# EAGLE design 16197^4 (EAGLE 7.6.0)
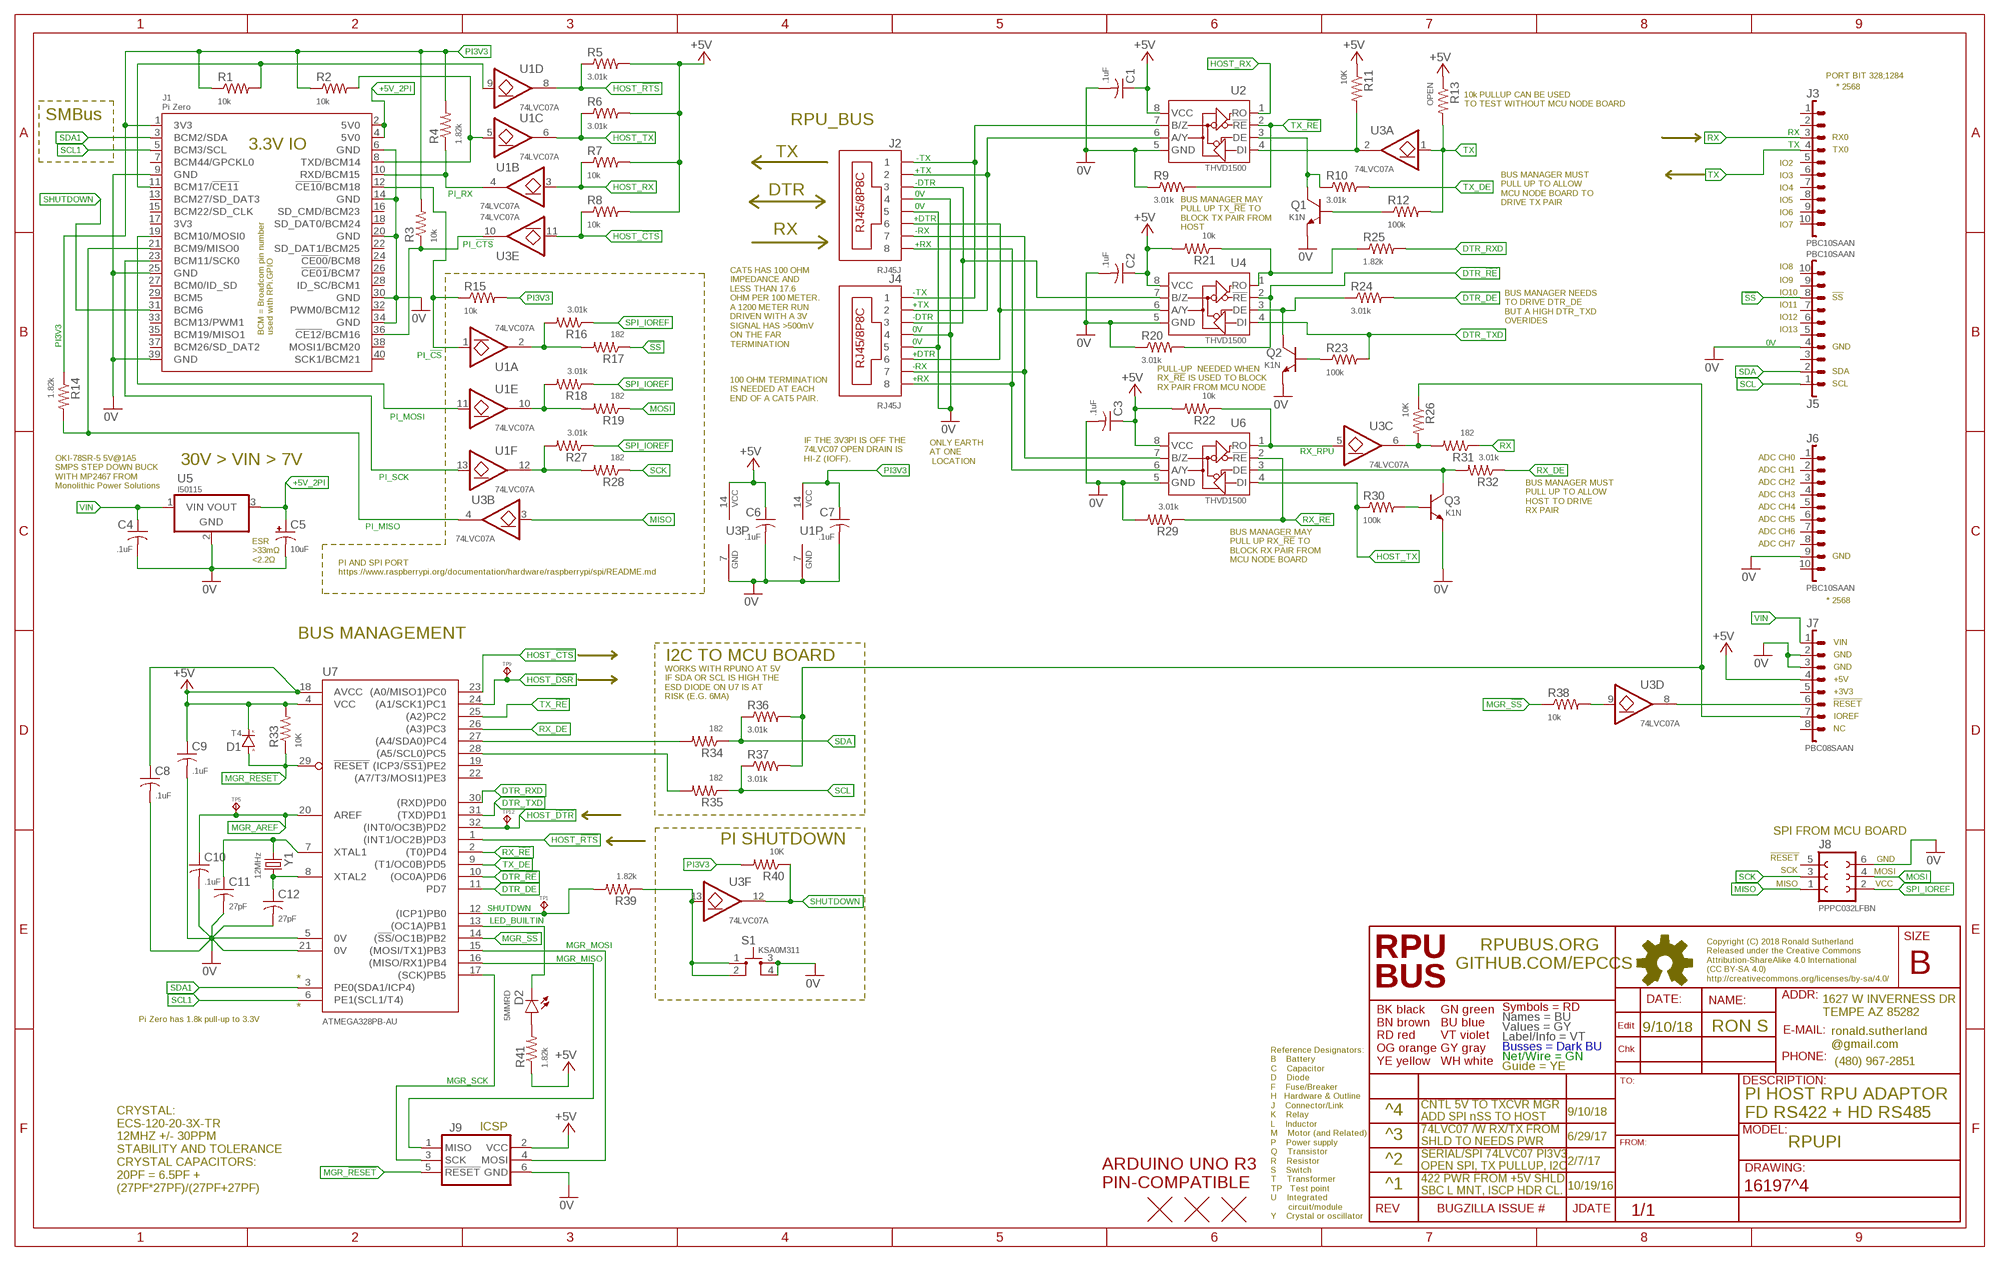
[diagram p0: schematic, sheet 1]

## Parts
C1  .1uF  CC0603A  [C0603(1608)]
C2  .1uF  CC0603A  [C0603(1608)]
C3  .1uF  CC0603A  [C0603(1608)]
C4  .1uF  CC0603A  [C0603(1608)]
C5  10uF  CT1206  [3216]
C6  .1uF  CC0603A  [C0603(1608)]
C7  .1uF  CC0603A  [C0603(1608)]
C8  .1uF  CC0603A  [C0603(1608)]
C9  .1uF  CC0603A  [C0603(1608)]
C10  .1uF  CC0603A  [C0603(1608)]
C11  27pF  CC0603A  [C0603(1608)]
C12  27pF  CC0603A  [C0603(1608)]
D1  T4  DSOD123  [SOD123]
D2  5MMRD  LED5MM  [LED5MM]
J1  Pi Zero  RPI-ZERO90  [RASPI_ZERO_V40PIN]
J2  RJ45J  RJ45-8HZT  [RJ45-8HZT]
J3  PBC10SAAN  1X10"  [1X10]
J4  RJ45J  RJ45-8HZT  [RJ45-8HZT]
J5  PBC10SAAN  1X10"  [1X10]
J6  PBC10SAAN  1X10"  [1X10]
J7  PBC08SAAN  1X8"  [1X8]
J8  PPPC032LFBN  F2X3  [F2X3]
J9  ISP-SPIPTH  [ISP]
Q1  K1N  NPNSOT23  [SOT23]
Q2  K1N  NPNSOT23  [SOT23]
Q3  K1N  NPNSOT23  [SOT23]
R1  10k  R0805  [C0805(2012)]
R2  10k  R0805  [C0805(2012)]
R3  10k  R0805  [C0805(2012)]
R4  1.82k  R0805  [C0805(2012)]
R5  3.01k  R0805  [C0805(2012)]
R6  3.01k  R0805  [C0805(2012)]
R7  10k  R0805  [C0805(2012)]
R8  10k  R0805  [C0805(2012)]
R9  3.01k  R0805  [C0805(2012)]
R10  3.01k  R0805  [C0805(2012)]
R11  10K  R0805  [C0805(2012)]
R12  100k  R0805  [C0805(2012)]
R13  OPEN  R0805  [C0805(2012)]
R14  1.82k  R0805  [C0805(2012)]
R15  10k  R0805  [C0805(2012)]
R16  3.01k  R0805  [C0805(2012)]
R17  182  R0805  [C0805(2012)]
R18  3.01k  R0805  [C0805(2012)]
R19  182  R0805  [C0805(2012)]
R20  3.01k  R0805  [C0805(2012)]
R21  10k  R0805  [C0805(2012)]
R22  10k  R0805  [C0805(2012)]
R23  100k  R0805  [C0805(2012)]
R24  3.01k  R0805  [C0805(2012)]
R25  1.82k  R0805  [C0805(2012)]
R26  10K  R0805  [C0805(2012)]
R27  3.01k  R0805  [C0805(2012)]
R28  182  R0805  [C0805(2012)]
R29  3.01k  R0805  [C0805(2012)]
R30  100k  R0805  [C0805(2012)]
R31  182  R0805  [C0805(2012)]
R32  3.01k  R0805  [C0805(2012)]
R33  10K  R0805  [C0805(2012)]
R34  182  R0805  [C0805(2012)]
R35  182  R0805  [C0805(2012)]
R36  3.01k  R0805  [C0805(2012)]
R37  3.01k  R0805  [C0805(2012)]
R38  10k  R0805  [C0805(2012)]
R39  1.82k  R0805  [C0805(2012)]
R40  10K  R0805  [C0805(2012)]
R41  1.82k  R0805  [C0805(2012)]
S1  KSA0M311  [0M311]
TP1  TPPAD1-08  [P1-08]
TP5  TPPAD1-08  [P1-08]
TP9  TPPAD1-08  [P1-08]
TP12  TPPAD1-08  [P1-08]
U1  74LVC07A  7407D  [14SOIC]
U2  THVD1500  ISL3172EIBZ  [SOIC8]
U3  74LVC07A  7407D  [14SOIC]
U4  THVD1500  ISL3172EIBZ  [SOIC8]
U5  I50115  OKI-78SR-H  [OKI-78SR-H]
U6  THVD1500  ISL3172EIBZ  [SOIC8]
U7  ATMEGA328PB-AU  [TQFP32-08]
U$1  ARDUINO-UNO  [ARDUINO_UNO]
U$2  FIDUCIAL1.27  [FIDUCIAL-1.27]
U$3  FIDUCIAL1.27  [FIDUCIAL-1.27]
U$4  FIDUCIAL1.27  [FIDUCIAL-1.27]
Y1  12MHz  CSM-3X  [CSM-3X]

## Nets
0V: C1.2 C2.2 C3.2 C4.2 C5.- C6.2 C7.2 C8.2 C9.2 C10.2 C11.2 C12.2 J1.6(GND) J1.9(GND) J1.14(GND) J1.20(GND) J1.25(GND) J1.30(GND) J1.34(GND) J1.39(GND) J2.4 J2.5 J4.4 J4.5 J5.4 J6.9 J7.2 J7.3 J8.6 J9.6(GND) Q1.E Q2.E Q3.E R9.1 R20.1 R29.2 S1.3 S1.4 U1.7(P:GND) U2.5(GND) U3.7(P:GND) U4.5(GND) U5.2(GND) U6.5(GND) U7.5(0V) U7.21(0V)
!RESET: J7.6 U3.8(D:O)
!SS: J5.8 R17.1
+5V: C1.1 C2.1 C3.1 C6.1 C8.1 C9.1 D1.C(K) J7.4 J9.2(VCC) R5.2 R6.2 R7.2 R8.2 R11.1 R13.1 R21.2 R22.2 R33.2 R41.1 U2.8(VCC) U3.14(P:VCC) U4.8(VCC) U6.8(VCC) U7.4(VCC) U7.18(AVCC)
+5V_2PI: C5.+ J1.2(5V0) J1.4(5V0) U5.3(VOUT)
+DTR: J2.6 J4.6 U4.6(A/Y)
+RX: J2.8 J4.8 U6.6(A/Y)
+TX: J2.2 J4.2 U2.6(A/Y)
-DTR: J2.3 J4.3 U4.7(B/Z)
-RX: J2.7 J4.7 U6.7(B/Z)
-TX: J2.1 J4.1 U2.7(B/Z)
DTR_!RE: R20.2 U4.2(!RE) U7.10((OC0A)PD6)
DTR_DE: R24.2 U7.11(PD7)
DTR_RXD: R25.2 U7.30((RXD)PD0)
DTR_TXD: R23.2 U4.4(DI) U7.31((TXD)PD1)
HOST_!CTS: R8.1 U3.11(E:I) U7.23((A0/MISO1)PC0)
HOST_!DSR: TP9.TP U7.24((A1/SCK1)PC1)
HOST_!DTR: TP12.TP U7.32((INT0/OC3B)PD2)
HOST_!RTS: R5.1 U1.8(D:O) U7.1((INT1/OC2B)PD3)
HOST_RX: R7.1 U1.3(B:I) U2.1(RO)
HOST_TX: R6.1 R30.1 U1.6(C:O) U6.4(DI)
IOREF: J7.7 R26.1 R36.2 R37.2
LED_BUILTIN: D2.K U7.13((OC1A)PB1)
MGR_!RESET: D1.A J9.5(!RESET) R33.1 U7.29(!RESET)
MGR_!SS!: R38.1 U7.14((!SS!/OC1B)PB2)
MGR_AREF: C10.1 TP5.TP U7.20(AREF)
MGR_MISO: J9.1(MISO) U7.16((MISO/RX1)PB4)
MGR_MOSI: J9.4(MOSI) U7.15((MOSI/TX1)PB3)
MGR_SCK: J9.3(SCK) U7.17((SCK)PB5)
MISO: J8.1 U3.3(B:I)
MOSI: J8.4 R19.1
N$1: J1.8(TXD/BCM14) R2.2 U1.5(C:I)
N$2: R38.2 U3.9(D:I)
N$3: R34.2 U7.27((A4/SDA0)PC4)
N$4: J1.11(BCM17/!CE11!) R1.2 U1.9(D:I)
N$5: R27.2 R28.2 U1.12(F:O)
N$6: R18.2 R19.2 U1.10(E:O)
N$7: R39.1 S1.1 S1.2 U3.13(F:I)
N$8: R35.2 U7.28((A5/SCL0)PC5)
N$9: R16.2 R17.2 U1.2(A:O)
N$10: R26.2 R31.2 U3.6(C:O)
N$11: Q3.C R32.2 U6.3(DE)
N$15: Q1.B R12.1
N$18: Q1.C R10.1 U2.3(DE)
N$19: R21.1 R25.1 U4.1(RO)
N$20: Q2.C R24.1 U4.3(DE)
N$22: Q2.B R23.1
N$25: Q3.B R30.2
N$29: D2.A R41.2
PI3V3: C7.1 J1.1(3V3) R1.1 R2.1 R3.2 R4.2 R14.1 R15.2 R40.2 U1.14(P:VCC)
PI_!CS: J1.12(!CE10!/BCM18) R15.1 U1.1(A:I)
PI_!CTS: J1.36(!CE12!/BCM16) R3.1 U3.10(E:O)
PI_MISO: J1.21(BCM9/MISO0) R14.2 U3.4(B:O)
PI_MOSI: J1.19(BCM10/MOSI0) U1.11(E:I)
PI_RX: J1.10(RXD/BCM15) R4.1 U1.4(B:O)
PI_SCK: J1.23(BCM11/SCK0) U1.13(F:I)
RX: J3.3 R31.1
RX_!RE: R29.1 U6.2(!RE) U7.2((T0)PD4)
RX_DE: R32.1 U7.26((A3)PC3)
RX_RPU: R22.1 U3.5(C:I) U6.1(RO)
SCK: J8.3 R28.1
SCL: J5.1 R35.1 R37.1
SCL1: J1.5(BCM3/SCL) U7.6(PE1(SCL1/T4))
SDA: J5.2 R34.1 R36.1
SDA1: J1.3(BCM2/SDA) U7.3(PE0(SDA1/ICP4))
SHUTDOWN: J1.31(BCM6) R40.1 U3.12(F:O)
SHUTDWN: R39.2 TP1.TP U7.12((ICP1)PB0)
SPI_IOREF: J8.2 R16.1 R18.1 R27.1
TX: J3.4 R12.2 R13.2 U3.1(A:I)
TX_!RE: R9.2 U2.2(!RE) U7.25((A2)PC2)
TX_DE: R10.2 U7.9((T1/OC0B)PD5)
TX_RPU: R11.2 U2.4(DI) U3.2(A:O)
VIN: C4.1 J7.1 U5.1(VIN)
XTAL1: C11.1 U7.7(XTAL1) Y1.1
XTAL2: C12.1 U7.8(XTAL2) Y1.2
Unconnected: J1.7(BCM44/GPCKL0) J1.13(BCM27/SD_DAT3) J1.15(BCM22/SD_CLK) J1.16(SD_CMD/BCM23) J1.17(3V3) J1.18(SD_DAT0/BCM24) J1.22(SD_DAT1/BCM25) J1.24(!CE00!/BCM8) J1.26(!CE01!/BCM7) J1.27(BCM0/ID_SD) J1.28(ID_SC/BCM1) J1.29(BCM5) J1.32(PWM0/BCM12) J1.33(BCM13/PWM1) J1.35(BCM19/MISO1) J1.37(BCM26/SD_DAT2) J1.38(MOSI1/BCM20) J1.40(SCK1/BCM21) J3.1 J3.2 J3.5 J3.6 J3.7 J3.8 J3.9 J3.10 J5.3 J5.5 J5.6 J5.7 J5.9 J5.10 J6.1 J6.2 J6.3 J6.4 J6.5 J6.6 J6.7 J6.8 J6.10 J7.5 J7.8 J8.5 U7.19((ICP3/!SS1!)PE2) U7.22((A7/T3/MOSI1)PE3)

## Notes on the sheet
- PORT BIT 328;1284
- * 2568
- 10k PULLUP CAN BE USED 
  TO TEST WITHOUT MCU NODE BOARD
- SMBus
- RPU_BUS
- RX0
- TX0
- TX
- IO2
- IO3
- IO4
- DTR
- IO5
- BUS MANAGER MUST
  PULL UP TO ALLOW 
  MCU NODE BOARD TO 
  DRIVE TX PAIR
- IO6
- IO7
- BUS MANAGER MAY
  PULL UP TX_!RE! TO 
  BLOCK TX PAIR FROM 
  HOST
- RX
- IO8
- IO9
- IO10
- !SS
- IO11
- IO12
- BUS MANAGER NEEDS
  TO DRIVE DTR_DE
  BUT A HIGH DTR_TXD
  OVERIDES
- IO13
- CAT5 HAS 100 OHM 
  IMPEDANCE AND 
  LESS THAN 17.6 
  OHM PER 100 METER. 
  A 1200 METER RUN
  DRIVEN WITH A 3V 
  SIGNAL HAS >500mV
  ON THE FAR
  TERMINATION
- GND
- SDA
- SCL
- PULL-UP  NEEDED WHEN 
  RX_!RE! IS USED TO BLOCK 
  RX PAIR FROM MCU NODE
- 100 OHM TERMINATION
  IS NEEDED AT EACH
  END OF A CAT5 PAIR.
- ADC CH0
- IF THE 3V3PI IS OFF THE
  74LVC07 OPEN DRAIN IS
  HI-Z (IOFF).
- ONLY EARTH
  AT ONE
   LOCATION
- 30V > VIN > 7V
- ADC CH1
- ADC CH2
- OKI-78SR-5 5V@1A5
  SMPS STEP DOWN BUCK
  WITH MP2467 FROM 
  Monolithic Power Solutions
- ADC CH3
- ADC CH4
- BUS MANAGER MUST
  PULL UP TO ALLOW 
  HOST TO DRIVE
  RX PAIR
- ADC CH5
- ADC CH6
- ADC CH7
- GND
- ESR
  >33mΩ
  <2.2Ω
- BUS MANAGER MAY
  PULL UP RX_!RE! TO 
  BLOCK RX PAIR FROM
  MCU NODE BOARD
- PI AND SPI PORT
  https://www.raspberrypi.org/documentation/hardware/raspberrypi/spi/README.md
- * 2568
- BUS MANAGEMENT
- VIN
- GND
- I2C TO MCU BOARD
- GND
- +5V
- +3V3
- WORKS WITH RPUNO AT 5V
  IF SDA OR SCL IS HIGH THE
  ESD DIODE ON U7 IS AT 
  RISK (E.G. 6MA)
- !RESET
- IOREF
- NC
- SPI FROM MCU BOARD
- PI SHUTDOWN
- !RESET
- GND
- SCK
- MOSI
- MISO
- VCC
- *
- *
- Pi Zero has 1.8k pull-up to 3.3V
- 9/10/18 | RON S
- ^4 | 9/10/18
- PI HOST RPU ADAPTOR 
  FD RS422 + HD RS485
- CNTL 5V TO TXCVR MGR
  ADD SPI nSS TO HOST
- ICSP
- ^3 | 6/29/17
- 74LVC07 /W RX/TX FROM 
  SHLD TO NEEDS PWR
- RPUPI
- ^2 | 2/7/17
- SERIAL/SPI 74LVC07 PI3V3
  OPEN SPI, TX PULLUP, I2C
- ^1 | 10/19/16
- CRYSTAL:
  ECS-120-20-3X-TR
  12MHZ +/- 30PPM
  STABILITY AND TOLERANCE
  CRYSTAL CAPACITORS:
  20PF = 6.5PF +
  (27PF*27PF)/(27PF+27PF)
- 422 PWR FROM +5V SHLD,
  SBC L MNT, ISCP HDR CL.

## Library data of the parts
C1-C4 C6-C12 = C-C:C: CAPACITOR Symbol
C5 = C-T:CT: Tantalum Electrolytic Capacitor
D1 = D-GP:D: DIODE
D2 = D-LED:LED: LED 120120WH [CREE,XHGAWT-00-0000-00000HXE1] LED WHITE 6500K 150LUM-W120120
J1 = U-Pi:RPI-ZERO: Raspberry Pi Zero https://pinout.xyz/ NOTE: WiFi is needed see https://www.kickstarter.com/projects/1991736672/iot-hat-for-raspberry-pi-a-must-have-for-pi-zero
J2 J4 = J-RJ45:RJ45-8: RJ45 Jack RJ45J [ASSMANN,A-2014-2-4-R] JACK MODULAR VERT PCB 8P8C UNSHIELD Horz version form sparkfun sku PRT-00643, and breakout board sku is BOB-00716.
J3 J5 J6 = J-HDR2.54mm:1X10: 10 POS HEADER PBC10S [SULLINS,PBC10SAAN]HEADER MALE BRKWAY 10POS .1IN AA
J7 = J-HDR2.54mm:1X8: 8 POS HEADER PBC08SAAN [SULLINS,PBC08SAAN]HEADER MALE BRKWAY 8POS .1IN AA
J8 = J-HDR2.54mm:F2X3: FEMALE HEADER 2X3POS
J9 = U-AVR:ISP-SPI: AVR ISP thru SPI In-System Programming uses the target Atmel AVR’s internal SPI (Serial Peripheral Interface) to download code into the flash and EEPROM memories. It is not a debugging interface. When designing an application PCB which includes an AVR with the SPI interface, this pinout should be used. Sparkfun SKU: BOB-08508
Q1-Q3 = Q-NPN:NPN: BJT NPN General Purpose Amplifier
R1-R41 = R-C:R: Resiistor American-style symbol
S1 = S-Tactile:KSA: KSA0M311 [C&K,KSA0M311LFT] SWITCH TACTILE SEALED SPST-NO 50MA 32V
TP1 TP5 TP9 TP12 = J-TP:TP: Test pad
U1 U3 = U-7400:74*07: HEX BUFFER, OPEN DRAIN/COLLECTOR 74LVC07A [DIODES,74LVC07AS14-13] LOGIC BUFFER OPEN DRAIN 14SOIC
U2 U4 U6 = U-Transceiver:ISL3172E: TRANSCEIVER RS485 3.3V HALFDPLX
U5 = P-DCDC:OKI-78SR: OKI-78SR OKI-78SR-5/1.5-W36H-C 5V@1.5A Horizontal Mount OKI-78SR-5/1.5-W36-C 5V@1.5A Vert Mount OKI-78SR-3.3/1.5-W36H-C 3.3V@1.5A Horizontal Mount OKI-78SR-3.3/1.5-W36-C 3.3V@1.5A Vert Mount Murata Power Solutions 7 to 36 VDC input range need to verify pinout
U7 = U-AVR:ATMEGA328PB-AU: ATmega328PB 4 Kbytes FLASH 128 bytes SRAM 256 bytes EEPROM 2 UART, 2 I2C, 2 SPI 8-channel 10 bit ADC
U$1 = J-BoardHDR:ARDUINO-UNO: Board Outline with holes and silk note the board dim layer is not defined
U$2-U$4 = H-Fiducial:FIDUCIAL: Fiducial Alignment Points Various fiducial points for machine vision alignment.
Y1 = Y-XTL:CSM: 16MHZ20 [ECS,ECS-160-20-3X-TR] CRYSTAL 16MHZ 20PF 30PPM CSM-3X

## Net classes
0 default: width 0.254 mm, drill 0.33 mm

## Board
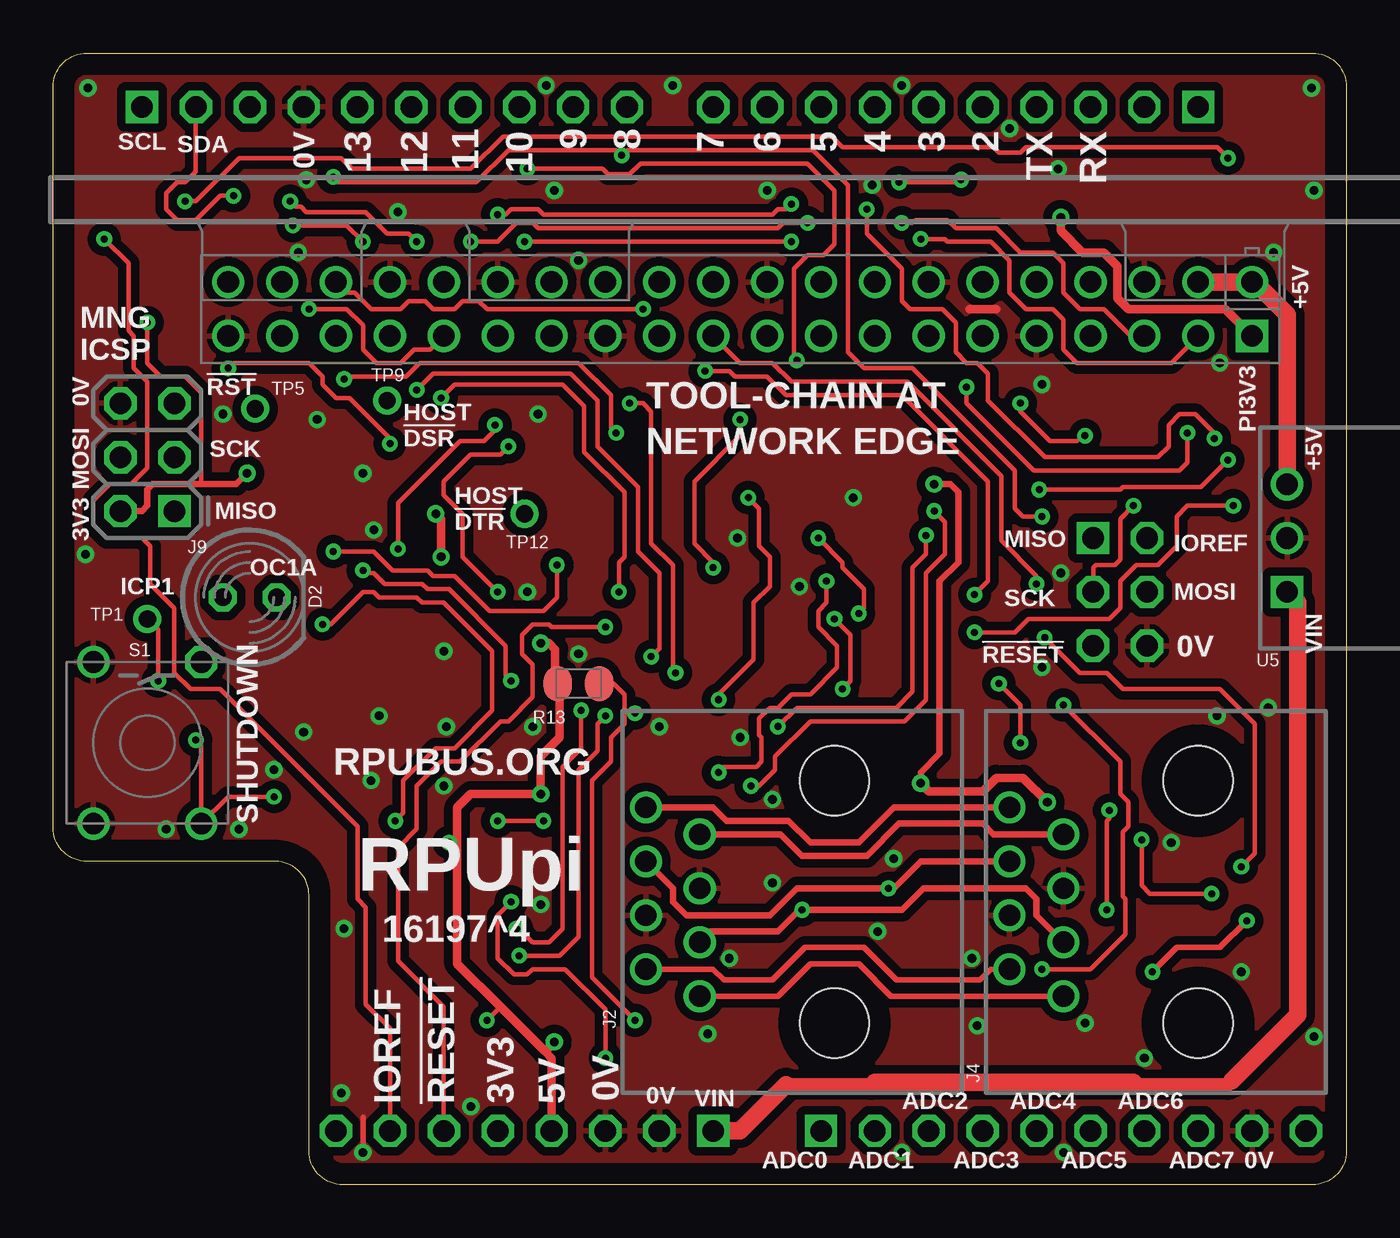
[diagram p1: board, top side]
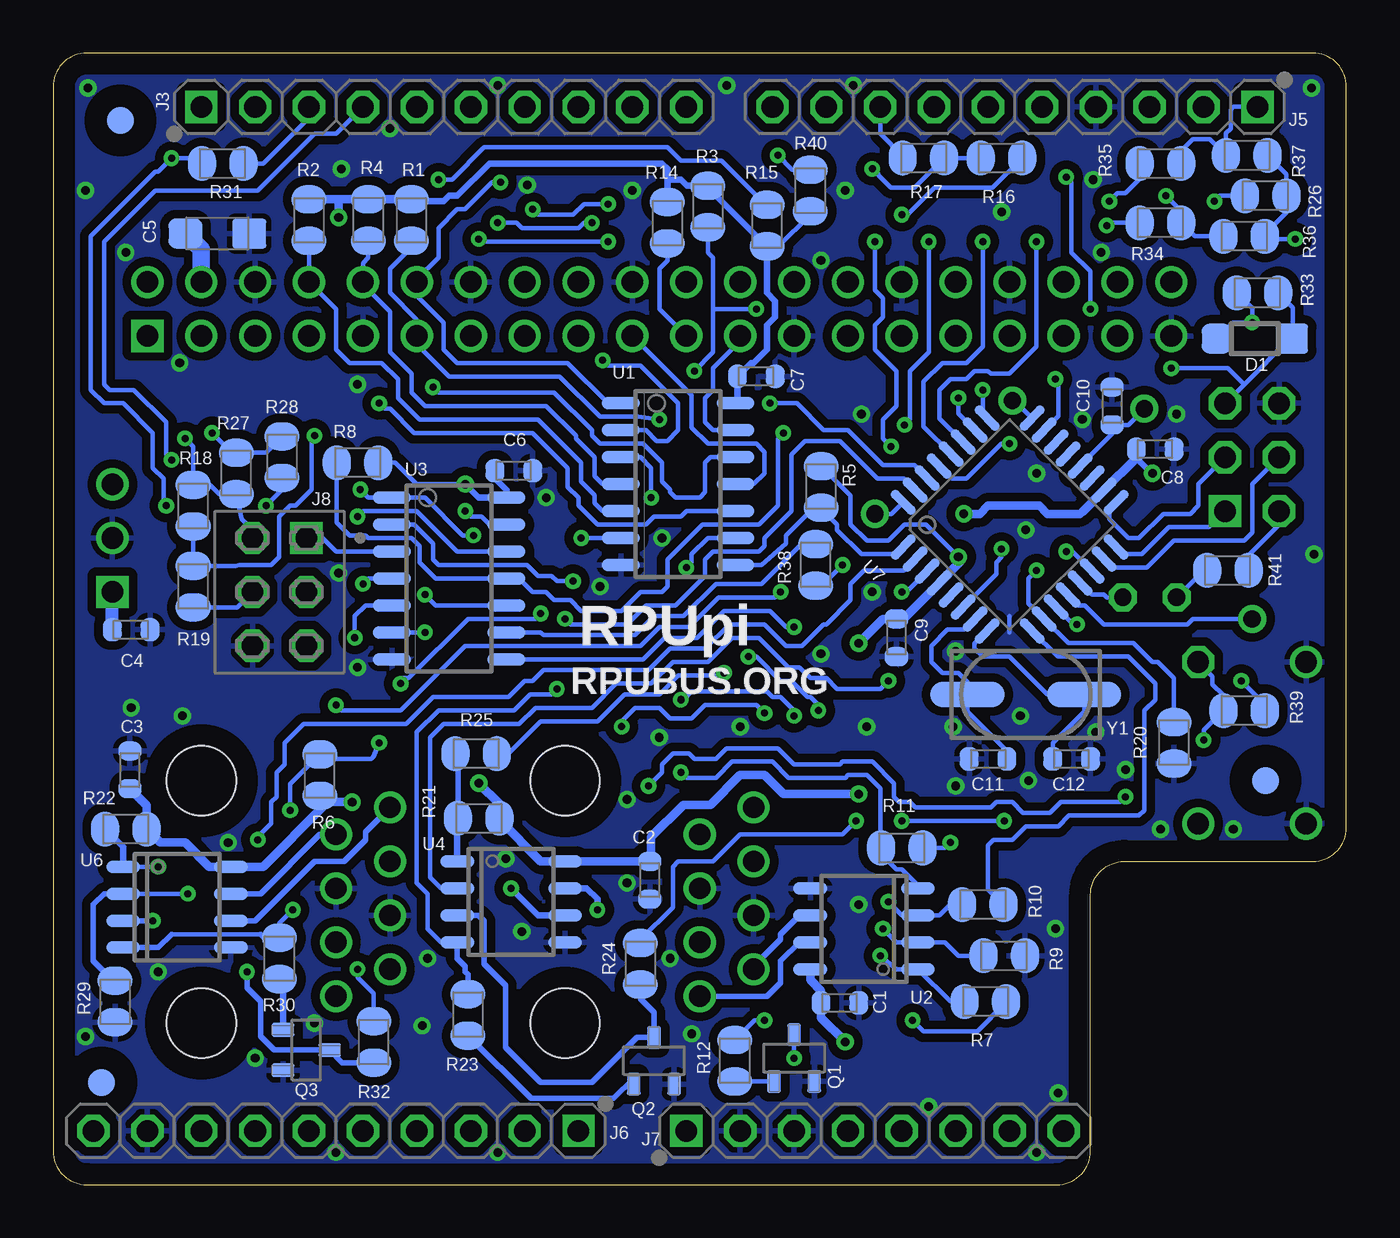
[diagram p2: board, bottom side, seen from below]

Size 60.96 x 53.34 mm. Coordinates in mm from the lower left corner, seen from the top.
Outline: 60.96,51.75 60.96,1.59 arc-90 59.37,0 13.65,0 arc-90 12.06,1.59 12.06,13.65 arc90 10.48,15.24 1.59,15.24 arc-90 0,16.83 0,51.75 arc-90 1.59,53.34 59.37,53.34 arc-90 60.96,51.75
Copper layers (1*16): Top 0.034290625mm / dielectric 60mil / Bottom 0.034290625mm
Design rules "default *": minimum track width 10mil, minimum drill 13mil, track to track 8mil, track to pad 8mil, pad to pad 8mil, via to via 8mil, smd to smd 8mil, copper to edge 40mil, drill to drill 12mil, minimum pad ring 10mil, minimum via ring 8mil, stop-mask expansion 4mil, vias tented up to drill 17mil, thermal gap 10mil

### Footprints (pad centres in the part's own frame; a part is rotated, then mirrored left to right if it is on the bottom)
C0603(1608) = smd 0.898 x 1.1: 1 -0.889,0; 2 0.889,0
3216 = smd 1.6 x 1.4: + -1.5,0; - 1.5,0
SOD123 = smd 1.4 x 1.4: A 1.8,0; C -1.8,0
LED5MM = drill 0.813 octagon: A -1.27,0; K 1.27,0
RASPI_ZERO_V40PIN = drill 1.016 square: 1 0,2.54 | drill 1.016: 2 0,0; 3 2.54,2.54; 4 2.54,0; 5 5.08,2.54; 6 5.08,0; 7 7.62,2.54; 8 7.62,0; 9 10.16,2.54; 10 10.16,0; 11 12.7,2.54; 12 12.7,0; 13 15.24,2.54; 14 15.24,0; 15 17.78,2.54; 16 17.78,0; 17 20.32,2.54; 18 20.32,0; 19 22.86,2.54; 20 22.86,0; 21 25.4,2.54; 22 25.4,0; 23 27.94,2.54; 24 27.94,0; 25 30.48,2.54; 26 30.48,0; 27 33.02,2.54; 28 33.02,0; 29 35.56,2.54; 30 35.56,0; 31 38.1,2.54; 32 38.1,0; 33 40.64,2.54; 34 40.64,0; 35 43.18,2.54; 36 43.18,0; 37 45.72,2.54; 38 45.72,0; 39 48.26,2.54; 40 48.26,0
RJ45-8HZT = drill 1: 1 -4.445,6.35; 2 -3.175,8.89; 3 -1.905,6.35; 4 -0.635,8.89; 5 0.635,6.35; 6 1.905,8.89; 7 3.175,6.35; 8 4.445,8.89 | hole 3.264: -5.715,0; 5.715,0
1X10 = drill 1.016 square: 1 0,0 | drill 1.016 octagon: 2 2.54,0; 3 5.08,0; 4 7.62,0; 5 10.16,0; 6 12.7,0; 7 15.24,0; 8 17.78,0; 9 20.32,0; 10 22.86,0
1X8 = drill 1.016 square: 1 0,0 | drill 1.016 octagon: 2 2.54,0; 3 5.08,0; 4 7.62,0; 5 10.16,0; 6 12.7,0; 7 15.24,0; 8 17.78,0
F2X3 = drill 1.016 square: 1 0,0 | drill 1.016 octagon: 2 0,-2.54; 3 2.54,0; 4 2.54,-2.54; 5 5.08,0; 6 5.08,-2.54
ISP = drill 1.016 square: 1 0,0 | drill 1.016 octagon: 2 0,2.54; 3 2.54,0; 4 2.54,2.54; 5 5.08,0; 6 5.08,2.54
SOT23 = smd 0.65 x 1.06: B -0.95,-1.1; C 0,1.1; E 0.95,-1.1
C0805(2012) = smd 1.321 x 1.651: 1 -0.977,0; 2 0.977,0
0M311 = drill 1.016 octagon: 1 -3.81,2.54 | drill 1.016: 2 3.81,2.54; 3 -3.81,-2.54; 4 3.81,-2.54
P1-08 = drill 0.813: TP 0,0
14SOIC = smd 0.6 x 1.8: 1 -3.81,-2.7; 2 -2.54,-2.7; 3 -1.27,-2.7; 4 0,-2.7; 5 1.27,-2.7; 6 2.54,-2.7; 7 3.81,-2.7; 8 3.81,2.7; 9 2.54,2.7; 10 1.27,2.7; 11 0,2.7; 12 -1.27,2.7; 13 -2.54,2.7; 14 -3.81,2.7
SOIC8 = smd 0.6 x 1.6: 1 -1.905,-2.54; 2 -0.635,-2.54; 3 0.635,-2.54; 4 1.905,-2.54; 5 1.905,2.54; 6 0.635,2.54; 7 -0.635,2.54; 8 -1.905,2.54
OKI-78SR-H = drill 1.016 square: 1 0,0 | drill 1.016: 2 -2.54,0; 3 -5.08,0
TQFP32-08 = smd 1.5 x 0.45: 1 -4.293,2.8; 2 -4.293,2; 3 -4.293,1.2; 4 -4.293,0.4; 5 -4.293,-0.4; 6 -4.293,-1.2; 7 -4.293,-2; 8 -4.293,-2.8; 17 4.293,-2.8; 18 4.293,-2; 19 4.293,-1.2; 20 4.293,-0.4; 21 4.293,0.4; 22 4.293,1.2; 23 4.293,2; 24 4.293,2.8 | smd 0.45 x 1.5: 9 -2.8,-4.293; 10 -2,-4.293; 11 -1.2,-4.293; 12 -0.4,-4.293; 13 0.4,-4.293; 14 1.2,-4.293; 15 2,-4.293; 16 2.8,-4.293; 25 2.8,4.293; 26 2,4.293; 27 1.2,4.293; 28 0.4,4.293; 29 -0.4,4.293; 30 -1.2,4.293; 31 -2,4.293; 32 -2.8,4.293
FIDUCIAL-1.27 = smd 1.27 x 1.27: 1 0,0
CSM-3X = smd 3.5 x 1.2: 1 -2.75,0; 2 2.75,0

### Placement (x,y rotation side)
C1  23.88,8.57 0 bottom
C2  32.83,14.35 270 bottom
C3  57.34,19.56 90 bottom
C4  57.28,26.16 0 bottom
C5  53.21,44.83 0 bottom
C6  39.24,33.66 0 bottom
C7  27.81,38.1 0 bottom
C8  9.02,34.67 0 bottom
C9  21.21,25.78 270 bottom
C10  11.05,36.7 90 bottom
C11  16.89,20.07 180 bottom
C12  12.95,20.07 0 bottom
D1  4.32,39.88 0 bottom
D2  9.27,27.69 0 top
J1  56.52,42.55 180 top
J2  36.83,13.34 90 top
J3  53.98,50.8 0 bottom
J4  53.98,13.34 90 top
J5  4.19,50.8 180 bottom
J6  36.2,2.54 180 bottom
J7  31.12,2.54 0 bottom
J8  49.02,30.48 270 bottom
J9  5.71,31.75 90 top
Q1  26.04,5.97 0 bottom
Q2  32.64,5.84 0 bottom
Q3  49.02,6.35 270 bottom
R1  44.07,45.47 270 bottom
R2  48.89,45.47 270 bottom
R3  30.1,46.1 90 bottom
R4  46.1,45.47 90 bottom
R5  24.77,32.89 90 bottom
R6  48.39,19.3 270 bottom
R7  17.02,8.64 0 bottom
R8  46.61,34.04 0 bottom
R9  16.13,10.79 180 bottom
R10  17.15,13.21 0 bottom
R11  20.96,15.88 180 bottom
R12  28.83,5.84 90 bottom
R13  24.77,23.62 0 top
R14  32,45.34 270 bottom
R15  27.31,45.21 270 bottom
R16  16.26,48.39 180 bottom
R17  19.94,48.39 0 bottom
R18  54.36,32 270 bottom
R19  54.36,28.19 90 bottom
R20  8.13,20.83 90 bottom
R21  40.89,17.27 0 bottom
R22  57.53,16.76 0 bottom
R23  41.4,8 90 bottom
R24  33.27,10.41 90 bottom
R25  41.02,20.32 0 bottom
R26  3.81,46.61 180 bottom
R27  52.32,33.53 90 bottom
R28  50.16,34.29 90 bottom
R29  58.04,8.64 270 bottom
R30  50.29,10.67 270 bottom
R31  52.96,48.13 180 bottom
R32  45.85,6.73 270 bottom
R33  4.19,42.04 180 bottom
R34  8.76,45.34 180 bottom
R35  8.76,48.13 180 bottom
R36  4.83,44.7 0 bottom
R37  4.7,48.51 0 bottom
R38  25.02,29.21 90 bottom
R39  4.83,22.35 0 bottom
R40  25.27,46.86 270 bottom
R41  5.59,28.96 180 bottom
S1  4.45,20.83 270 top
TP1  4.45,26.67 0 top
TP5  9.53,36.58 0 top
TP9  15.75,36.96 0 top
TP12  22.23,31.62 0 top
U1  31.5,33.02 270 bottom
U2  22.73,12.06 90 bottom
U3  42.29,28.57 270 bottom
U4  39.37,13.34 270 bottom
U5  58.17,27.94 270 top
U6  55.12,13.08 270 bottom
U7  15.88,31.11 45 bottom
U$1  -14.61,0 0 top  (outside the outline)
U$2  57.78,50.16 0 bottom
U$3  3.81,19.05 0 bottom
U$4  58.67,4.83 0 bottom
Y1  15.11,23.11 0 bottom

### Tracks (layer width: path | path; a pad name or v marks a point on that pad's centre or on a via)
0V  (via drill 0.41)
  Top 0.254: 14.61,1.78 14.61,3.17
  Top 0.406: 43.18,41.27 44.45,41.27
  Bottom 0.203: 15.88,26.04 15.88,26.8
  other vias: 1.65,51.69 23.24,51.82 29.21,51.82 59.31,51.69 56.01,10.03 54.86,22.1 33.66,46.86 48.64,7.62 38.86,11.94 1.52,29.72 8.76,16.76 52.7,16.13 59.44,46.86 13.59,4.32 33.91,14.22 30.86,7.11 43.31,10.67 35.18,28.19 32.38,21.08 32.26,30.48 14.99,19.05 18.42,18.8 43.56,7.49 57.28,22.48 59.44,6.99 51.43,5.97 15.37,22.1 18.42,25.15 22.99,13.21 19.69,3.68 22.61,21.59 15.11,30.86 14.61,33.53 8,36.32 11.56,43.94 54.99,38.73 37.72,32.38 46.61,24.38 31.88,10.67 18.54,21.59 11.81,21.34 28.58,21.59 22.35,27.94 22.86,36.32 47.5,28.83 39.62,15.37 24.77,25.02 13.72,12.06 33.91,18.16 46.61,37.72 47.37,47.88 38.61,47.12 45.09,49.78 40,51.82 57.53,43.94 47.62,1.52 40,1.52 14.61,1.52 5.33,16.76 10.41,19.56 11.94,47.37 16.26,45.85 24.77,43.56 23.62,46.86 12.45,36.07
  pour Top (isolate 0.406): 11.43,0 11.43,14.61 0,14.61 0,53.34 60.96,53.34 60.96,0
  pour Bottom (isolate 0.406): 0,53.34 60.96,53.34 60.96,0 11.43,0 11.43,14.61 0,14.61
!RESET  (via drill 0.33)
  Top 0.203: J7.6 18.42,8.38 16.26,10.54 16.26,15.88 17.15,16.76 17.15,18.8 18.29,19.94 19.18,19.94 21.08,21.84 21.46,21.84 22.61,22.99 22.61,24.51 22.1,25.02 22.1,25.91 22.61,26.42 23.37,26.42 23.5,26.29 v26.04,26.29
  Bottom 0.203: U3.8 33.15,24.77 32.13,25.78 30.61,25.78 29.34,27.05 27.18,27.05 26.42,26.29 v26.04,26.29
!SS
  Bottom 0.203: R17.1 20.92,48.48 21.97,49.53 J5.8
+5V  (via drill 0.33, 0.41)
  Top 0.203: v20.45,7.75 21.08,8.38 | v18.67,16.13 19.05,16.13 | v4.45,40.64 4.45,38.73 5.08,38.1 6.22,38.1 6.98,37.34 6.98,33.02
  Top 0.305: v40.89,18.92 40.89,19.43 41.78,20.32 41.78,28.45 42.67,29.34 42.67,32.64 42.29,33.02 v41.53,33.02 | v9.14,33.53 8.64,33.02 6.98,33.02 4.7,33.02 4.45,32.77 4.45,32 4.19,31.75 J9.2
  Top 0.406: 23.18,6.29 23.5,5.97 J7.4 | 23.18,6.29 21.08,8.38 19.05,10.41 19.05,16.13 19.05,17.78 19.69,18.41 v22.99,18.41 22.99,20.19 23.88,21.08 23.88,23.53 R13.1 23.75,23.62 23.66,23.71 23.66,25.23 23.37,25.53 v22.99,25.53 | v40.89,18.92 41.27,18.54 43.81,18.54 44.45,19.18 45.72,19.18 v46.86,18.03 | v18.29,29.59 18.29,31.37 v18.03,31.62 | v23.62,6.73 23.18,6.29
  Bottom 0.203: v18.29,29.59 19.81,31.11 20.83,31.11 21.59,30.35 22.61,30.35 23.37,31.11 23.37,32.47 R5.2 | D1.C 5.36,40.64 v4.45,40.64 4.45,41.31 R33.2 | R41.1 4.61,29.68 3.17,31.11 J9.2 | v41.53,33.02 43.81,33.02 44.83,34.04 R8.2 | R11.1 18.92,15.88 v18.67,16.13 | R7.2 16.04,8.6 17.4,7.24 19.94,7.24 v20.45,7.75 | R6.2 48.64,18.29 48.2,17.84
  Bottom 0.305: R21.2 39.92,17.18 | 5.17,42.62 R33.2 | 9.91,34.26 9.18,33.53 v9.14,33.53 | v41.53,33.02 40.89,32.38 U3.14 39.59,32.73 40.13,33.27 C6.1
  Bottom 0.406: 57.53,18.67 C3.1 56.55,17.88 R22.2 55.92,16.13 54.74,16.13 53.59,14.99 U6.8 51.05,14.99 48.2,17.84 48.01,18.03 v46.86,18.03 | 39.92,17.18 37.97,15.24 U4.8 C2.1 32.77,15.3 32.77,16.38 31.24,17.91 29.97,17.91 28.58,19.3 27.43,19.3 26.54,18.41 v22.99,18.41 | v40.89,18.92 39.92,17.95 R21.2 | v22.99,25.53 21.84,26.67 C9.1 20.89,26.67 U7.4 18.29,29.27 v18.29,29.59 18.22,29.34 | v18.03,31.62 17.27,31.62 16.89,32 14.48,32 14.1,31.62 12.57,31.62 12.45,31.72 U7.18 9.91,34.26 C8.1 | v23.62,6.73 24.77,7.87 C1.1 24.77,9.14 25.27,9.65 U2.8
+5V_2PI
  Top 0.813: U5.3 58.17,41.02 56.64,42.55 J1.2 J1.4
  Bottom 0.813: J1.4 53.98,44.09 C5.+
+DTR  (via drill 0.33)
  Top 0.305: J4.6 40.89,15.24 39.62,13.97 v39.37,13.97 35.05,13.97 33.78,12.7 29.85,12.7 29.21,13.34 29.21,13.97 J2.6
  Bottom 0.305: U4.6 38.1,12.7 v39.37,13.97
+RX
  Top 0.305: J4.8 39.62,17.78 37.97,16.13 35.69,16.13 34.67,17.14 31.75,17.14 31.12,17.78 J2.8
  Bottom 0.254: U6.6 51.43,12.45 48.64,15.24 47.24,15.24 46.23,16.26 46.23,16.64 J4.8
+TX
  Top 0.254: J4.2 44.2,10.16 43.69,9.65 39.75,9.65 38.23,11.18 35.43,11.18 33.91,9.65 31.62,9.65 31.12,10.16 J2.2
  Bottom 0.254: U2.6 25.78,12.7 26.67,11.81 26.67,11.56 27.94,10.29 J2.2
-DTR  (via drill 0.33)
  Top 0.305: J4.3 46.35,12.7 46.35,13.46 45.85,13.97 41.02,13.97 40,12.95 v35.31,12.95 35.18,12.95 34.16,11.94 30.99,11.94 J2.3
  Bottom 0.305: U4.7 35.81,13.97 35.31,13.46 v35.31,12.95
-RX
  Top 0.305: J2.7 34.29,16.51 35.31,15.49 38.35,15.49 39.88,17.02 43.81,17.02 44.32,16.51 J4.7
  Bottom 0.254: U6.7 51.18,13.72 48.39,16.51 J4.7
-TX
  Top 0.254: J4.1 39.5,8.89 37.97,10.41 35.69,10.41 34.16,8.89 J2.1
  Bottom 0.254: J2.1 27.31,8.89 26.67,9.53 26.67,10.54 25.78,11.43 U2.7
DTR_!RE  (via drill 0.33)
  Top 0.203: v21.59,23.75 21.34,24 21.34,25.4 18.67,28.07 17.65,28.07 17.4,28.32 15.62,28.32 15.11,28.83 14.73,28.83 v14.61,28.96
  Bottom 0.203: U4.2 42.67,13.97 43.18,14.48 43.18,21.08 42.54,21.72 38.99,21.72 38.23,22.48 35.56,22.48 34.42,23.62 32.77,23.62 31.75,24.64 30.1,24.64 28.96,25.78 27.69,25.78 26.29,24.38 25.78,24.38 25.27,23.88 24.51,23.88 24,23.37 21.97,23.37 v21.59,23.75 | R20.2 8.13,23.88 8.89,24.64 9.14,24.64 10.03,25.53 13.12,25.53 U7.10 14.99,27.4 14.99,28.57 v14.61,28.96
DTR_DE  (via drill 0.33)
  Top 0.203: v12.7,26.42 13.08,26.42 14.61,27.94 15.11,27.94 15.37,27.69 17.15,27.69 17.4,27.43 18.42,27.43 20.7,25.15 20.7,22.35 18.92,20.57 18.03,20.57 16.51,19.05 16.51,17.53 v16.13,17.14 | v23.11,17.14 v20.96,17.14
  Bottom 0.203: R24.2 33.27,11.56 31.75,13.08 31.75,14.99 31.5,15.24 29.85,15.24 28.58,16.51 23.75,16.51 v23.11,17.14 | U7.11 12.87,26.42 v12.7,26.42 | v16.13,17.14 v20.96,17.14
DTR_RXD  (via drill 0.33)
  Top 0.203: v27.18,36.83 27.81,36.83 28.19,36.45 28.19,30.23 29.21,29.21 29.21,24.26 v29.34,24.13
  Bottom 0.203: R25.2 39.5,20.32 37.97,21.84 35.31,21.84 34.04,23.11 32.38,23.11 31.5,24 29.46,24 v29.34,24.13 | U7.30 20.37,33.91 21.84,33.91 23.5,35.56 24.64,35.56 25.91,36.83 v27.18,36.83
DTR_TXD  (via drill 0.33)
  Top 0.203: v37.21,23.37 37.59,23.75 37.59,25.91 v36.83,26.67
  Bottom 0.203: U4.4 42.67,11.43 43.31,12.06 43.31,13.72 43.81,14.22 43.81,21.34 42.8,22.35 39.24,22.35 38.48,23.11 37.46,23.11 v37.21,23.37 | U7.31 20.86,33.27 22.1,33.27 23.88,35.05 25.53,35.05 26.16,34.42 26.16,31.75 27.43,30.48 27.43,30.1 27.69,29.84 29.85,29.84 30.23,29.46 30.23,28.7 31.62,27.3 33.02,27.3 33.91,26.42 36.58,26.42 v36.83,26.67
  Bottom 0.254: R23.2 41.4,9.91 41.53,10.03 41.53,10.29 41.91,10.67 U4.4
HOST_!CTS  (via drill 0.33)
  Top 0.203: v13.72,37.97 13.84,38.1 16.64,38.1 17.27,38.73 24.77,38.73 26.29,37.21 26.29,35.69 v26.54,35.43
  Bottom 0.203: U7.23 13.59,36.23 13.59,37.85 v13.72,37.97 | v26.54,35.43 26.8,35.18 26.8,32 27.69,31.11 30.35,31.11 32,29.46 32,28.19 32.26,27.94 33.27,27.94 34.16,27.05 36.07,27.05 36.58,27.56 37.34,27.56 37.72,27.94 38.35,27.94 38.99,28.57 U3.11 42.93,28.57 43.69,29.34 43.69,30.1 44.07,30.48 46.1,30.48 46.23,30.61 46.99,30.61 47.59,31.2 R8.1
HOST_!DSR
  Bottom 0.203: U7.24 15.65,36.96 TP9.TP
HOST_!DTR
  Bottom 0.203: U7.32 21.44,31.62 TP12.TP
HOST_!RTS
  Bottom 0.203: U7.1 21.23,29.72 22.86,29.72 24,30.86 24,31.11 24.77,31.88 R5.1 25.11,31.92 26.42,30.61 26.42,30.23 27.56,29.21 U1.8
HOST_RX  (via drill 0.33)
  Top 0.203: v26.04,22.1 25.65,21.72 25.65,20.45 24.77,19.56 24.77,11.68 23.88,10.79 v21.97,10.79 | v32.77,32.38 33.27,31.88 33.27,30.1 33.78,29.59 33.78,28.19 33.02,27.43 33.02,24.77 31.37,23.11 v31.37,22.86
  Bottom 0.203: v26.04,22.1 26.04,22.35 26.67,22.99 27.05,22.99 27.31,23.24 30.86,23.24 31.24,22.86 v31.37,22.86 | v32.77,32.38 32.77,33.78 33.27,34.29 U1.3 | R7.1 18.67,8.64 U2.1 21.21,10.16 v21.97,10.79
HOST_TX  (via drill 0.33)
  Top 0.203: v49.66,12.95 49.66,17.14 49.78,17.27 v49.78,17.65 | v45.59,20.83 45.59,22.61 v44.58,23.62 | v37.97,26.92 38.23,27.18 38.23,28.07 37.21,29.08 37.21,29.34 v36.07,30.48
  Bottom 0.203: 51.18,11.81 55.37,11.81 | R30.1 50.29,12.32 v49.66,12.95 | v45.59,20.83 45.85,20.19 45.97,20.07 48.43,20.07 R6.1 49.78,18.88 v49.78,17.65 | v44.58,23.62 44.58,23.75 44.45,23.88 44.2,23.88 41.4,26.67 38.23,26.67 v37.97,26.92 | v36.07,30.48 U1.6
  Bottom 0.254: R30.1 50.76,11.39 51.18,11.81 | 55.37,11.81 56.01,11.18 U6.4
IOREF  (via drill 0.33)
  Top 0.203: J7.7 15.88,7.37 14.73,8.51 14.73,13.08 14.35,13.46 14.35,16.89 7.87,23.37 6.48,23.37 5.71,24.13 5.71,27.18 4.57,28.32 4.57,30.1 4.19,30.48 2.54,30.48 1.91,31.11 1.91,32.26 2.67,33.02 3.68,33.02 4.45,33.78 4.45,37.85 3.81,38.48 3.81,40.01 3.56,40.26 3.56,43.43 v2.41,44.58
  Bottom 0.203: v2.41,44.58 3.72,44.58 R36.2 3.85,44.79 2.83,45.81 R26.1 2.83,47.62 R37.2
LED_BUILTIN
  Bottom 0.203: U7.13 12.01,27.81 11.43,27.81 11.3,27.69 D2.K
MGR_!RESET  (via drill 0.33)
  Top 0.203: v8.26,38.48 8.51,38.73 12.06,38.73 12.7,38.1 12.7,37.72 13.33,37.08 13.97,37.08 15.88,35.18 v15.88,34.92
  Bottom 0.203: J9.5 4.83,37.72 | 4.83,37.72 2.67,39.88 D1.A 2.52,41.34 R33.1 | v8.26,38.48 5.59,38.48 4.83,37.72 | U7.29 18.6,33.27 17.91,33.27 16.26,34.92 v15.88,34.92
MGR_!SS!  (via drill 0.33)
  Top 0.203: v23.75,29.21 23.75,27.69 23.11,27.05 20.57,27.05 18.92,28.7 17.91,28.7 17.65,28.96 16,28.96 15.11,29.84 v13.21,29.84
  Bottom 0.203: v13.21,29.84 12.91,29.84 U7.14 | R38.1 24.73,28.23 v23.75,29.21
MGR_AREF
  Bottom 0.203: U7.20 11.05,35.38 C10.1 10.29,35.81 TP5.TP
MGR_MISO
  Bottom 0.203: U7.16 10.52,29.72 9.65,29.72 8.38,30.99 6.48,30.99 J9.1
MGR_MOSI
  Bottom 0.203: U7.15 11.02,29.08 9.4,29.08 8.13,30.35 4.83,30.35 4.45,30.73 4.45,33.02 J9.4
MGR_SCK
  Bottom 0.203: U7.17 11.18,31.85 11.18,31.37 10.29,30.48 9.78,30.48 8.64,31.62 7.37,31.62 6.98,32 6.98,33.02 J9.3
MISO
  Bottom 0.203: J8.1 48.26,30.48 47.62,29.84 U3.3
MOSI
  Bottom 0.203: J8.4 52.28,27.22 R19.1
N$1
  Bottom 0.203: R2.2 J1.8 47.62,41.27 47.62,39.37 46.99,38.73 45.47,38.73 44.7,37.97 44.7,37.08 43.69,36.07 38.1,36.07 36.07,34.04 36.07,33.15 35.43,32.51 35.43,32.13 35.05,31.75 U1.5
N$2
  Bottom 0.203: U3.9 37.97,26.04 37.85,25.91 33.53,25.91 32.64,26.8 31.24,26.8 29.72,28.32 27.56,28.32 25.69,30.19 R38.2
N$3  (via drill 0.33)
  Top 0.203: v14.61,44.45 13.84,45.21 v11.3,45.21
  Bottom 0.203: U7.27 19.18,36.11 19.18,37.47 18.67,37.97 17.91,37.97 17.53,38.35 16.89,38.35 16.76,38.23 15.88,38.23 14.61,39.5 v14.61,44.45 | R34.2 11.18,45.34 v11.3,45.21
N$4  (via drill 0.33)
  Top 0.203: v32.38,36.07 32.38,35.31 30.23,33.15 30.23,30.23 31.12,29.34 v31.12,29.08
  Bottom 0.203: R1.2 44.07,44.2 45.09,43.18 45.09,42.04 43.81,40.77 J1.11 43.81,39.62 42.29,38.1 37.08,38.1 35.18,36.2 33.4,36.2 v32.38,36.07 | v31.12,29.08 30.86,29.34 30.86,29.72 30.1,30.48 U1.9
N$5  (via drill 0.33)
  Top 0.203: v43.05,37.59 43.05,36.83 46.23,33.66 53.09,33.66 53.47,34.04 v53.47,35.43
  Bottom 0.203: R28.2 50.93,34.51 R27.2 52.54,34.51 v53.47,35.43 | v43.05,37.59 42.8,37.34 37.34,37.34 35.56,35.56 35.56,35.31 35.18,34.92 33.15,34.92 32.26,34.04 32.26,33.15 31.88,32.77 31.88,32.64 31.62,32.38 30.48,32.38 30.23,32.64 30.23,34.04 29.97,34.29 U1.12
N$6  (via drill 0.33)
  Top 0.203: v45.59,36.83 45.59,36.45 46.99,35.05 48.26,35.05 v48.64,35.31
  Bottom 0.203: U1.10 31.12,31.75 31.37,31.5 32.64,31.5 33.02,31.11 35.31,31.11 36.2,32 36.2,32.38 36.7,32.89 36.7,33.78 38.35,35.43 43.94,35.43 45.09,36.58 45.34,36.58 v45.59,36.83 | R18.2 R19.2 52.36,29.17 52.2,29.21 50.67,29.21 50.29,29.59 50.29,31.5 49.78,32 49.53,32 48.77,32.77 48.77,35.18 v48.64,35.31
N$7  (via drill 0.33)
  Top 0.203: v6.73,20.95 6.98,20.7 S1.2 8.26,18.29 v10.41,18.29 | v32.89,18.8 33.27,18.8 34.04,19.56 34.04,20.19 35.69,21.84 40.13,21.84 41.15,22.86 41.15,28.83 42.04,29.72 42.04,31.24 v41.53,31.75
  Bottom 0.203: S1.1 6.31,23.96 6.31,23.58 5.8,23.07 R39.1 6.73,21.42 v6.73,20.95 | v10.41,18.29 10.67,18.03 13.46,18.03 13.97,17.53 15.24,17.53 15.75,18.03 16.51,18.03 16.76,17.78 20.32,17.78 20.57,18.03 21.08,18.03 21.34,18.29 21.34,18.92 22.35,19.94 23.75,19.94 23.88,19.81 26.04,19.81 26.8,20.57 29.21,20.57 29.72,20.07 30.73,20.07 30.99,20.32 31.75,20.32 32.26,19.81 32.26,19.43 v32.89,18.8 | U3.13 40.39,31.11 40.77,31.5 41.27,31.5 v41.53,31.75
N$8  (via drill 0.33)
  Top 0.203: v17.15,44.45 16.76,44.83 15.75,44.83 14.73,45.85 11.94,45.85 11.68,46.1 11.43,46.1 v11.18,46.35
  Bottom 0.203: U7.28 19.94,35.74 19.94,37.85 19.05,38.73 17.91,38.73 17.15,39.5 v17.15,44.45 | R35.2 9.61,47.54 10.41,46.74 10.79,46.74 v11.18,46.35
N$9  (via drill 0.33)
  Top 0.203: v35.05,38.86 34.92,38.99 34.92,43.18 35.56,43.81 36.32,43.81 36.83,44.32 36.83,46.86 35.56,48.13 27.69,48.13 27.18,47.62 26.16,47.62 25.91,47.88 v22.35,47.88
  Bottom 0.203: U1.2 33.02,35.56 32.51,35.05 32,35.05 31.5,35.56 31.5,36.83 33.27,38.61 34.8,38.61 v35.05,38.86 | v22.35,47.88 22.06,47.62 22.06,47.59 21.46,46.99 20.36,46.99 R17.2 R16.2
N$10  (via drill 0.33)
  Top 0.203: v43.43,26.04 45.34,26.04 45.97,26.67 49.78,26.67 50.29,27.18 50.29,28.45 51.05,29.21 52.07,29.21 52.96,30.1 52.96,31.5 53.47,32 v55.63,32 | v6.22,46.35 6.73,46.35 8.76,48.39 13.59,48.39 14.1,47.88 19.69,47.88 21.21,49.4 36.7,49.4 37.21,48.9 44.32,48.9 44.58,48.64 45.59,48.64 45.85,48.9 54.86,48.9 v55.37,48.39
  Bottom 0.203: v43.43,26.04 U3.6 | R26.2 5.97,46.61 v6.22,46.35 | R31.2 54.06,48.39 v55.37,48.39 56.01,47.75 56.13,47.75 59.18,44.7 59.18,37.47 58.55,36.83 57.66,36.83 56.26,35.43 56.26,33.78 55.75,33.27 55.75,32.13 v55.63,32
N$11  (via drill 0.33)
  Top 0.254: v51.82,10.03 52.96,11.18 54.99,11.18 v56.26,12.45
  Bottom 0.254: R32.2 47.33,5.75 Q3.C 50.55,6.35 51.18,6.99 51.18,8.64 51.82,9.27 v51.82,10.03 | v56.26,12.45 U6.3
N$15
  Bottom 0.203: Q1.B R12.1
N$18  (via drill 0.33)
  Top 0.203: v26.04,5.97 26.04,8.26 24.13,10.16 22.61,10.16 22.35,9.91 21.72,9.91 20.96,10.67 20.96,12.7 v21.59,13.34
  Bottom 0.203: R10.1 18.67,13.21 19.18,12.7 U2.3 20.96,12.7 v21.59,13.34 | Q1.C v26.04,5.97
N$19
  Bottom 0.254: R21.1 41.87,20.19 R25.1
  Bottom 0.305: U4.1 41.91,17.23 R21.1
N$20
  Bottom 0.254: U4.3 40.89,12.7 40.64,12.45 40.64,10.41 39.62,9.4 39.62,6.48 37.97,4.83 35.56,4.83 33.44,6.94 Q2.C 32.64,8.13 33.27,8.76 R24.1
N$22
  Bottom 0.254: Q2.B 33.59,5.02 34.54,4.06 38.44,4.06 R23.1
N$25
  Bottom 0.305: Q3.B 50.12,9.35 R30.2
N$29
  Bottom 0.203: R41.2 6.73,28.96 D2.A
PI3V3  (via drill 0.41)
  Top 0.406: J1.1 55.24,41.27 50.67,41.27 50.16,41.78 50.16,43.31 49.53,43.94 48.51,43.94 47.5,44.96 v47.5,45.59
  Bottom 0.203: R40.2 25.27,45.72 26.76,44.23 R15.2
  Bottom 0.305: U1.14 28.7,36.92 C7.1 28.07,38.73 27.94,38.73 27.31,39.37 27.31,40.51 26.92,40.89 26.92,41.66 27.31,42.04 R15.2 27.34,44.23 30.1,46.99 R3.2 31.08,47.08 31.37,47.37 32,47.37 | 32,47.37 32,47.88 32.26,48.13 40.39,48.13 41.91,46.61 42.29,46.61 42.54,46.35 43.43,46.35 43.56,46.48 43.73,46.61 R1.1 | 32,47.37 R14.1
  Bottom 0.406: 47.5,46.44 v47.5,45.59 | R2.1 47.5,46.44 | 47.5,46.44 R4.2 R1.1 | 32.13,46.44 R14.1
PI_!CS  (via drill 0.33)
  Top 0.203: v39.88,47.24 42.67,47.24 v42.8,47.37
  Bottom 0.203: U1.1 34.8,36.83 36.7,38.73 41.91,38.73 42.54,39.37 42.54,40.64 43.81,41.91 J1.12 43.81,42.67 42.8,43.69 42.8,45.09 41.91,45.97 41.53,45.97 40.26,47.24 v39.88,47.24 | R15.1 27.39,46.19 29.46,48.26 31.37,48.26 32,48.9 40.64,48.9 42.16,47.37 v42.8,47.37
PI_!CTS  (via drill 0.33)
  Top 0.203: J1.36 13.84,42.04 14.22,42.04 14.99,41.27 16.38,41.27 16.76,41.66 17.53,41.66 17.91,41.27 18.92,41.27 19.3,41.66 20.07,41.66 20.45,41.27 v27.81,41.27 | v30.73,38.35 31.88,38.35 32.13,38.1 33.66,38.1 34.54,37.21 40,37.21 44.07,33.15 44.07,28.45 v43.43,27.81
  Bottom 0.203: 29.85,41.27 29.85,39.24 v30.73,38.35 | 29.85,41.27 29.85,43.69 30.1,43.94 R3.1 | v43.43,27.81 42.93,27.3 U3.10 | v27.81,41.27 29.85,41.27
PI_MISO  (via drill 0.33)
  Top 0.203: v46.35,28.32 46.35,28.7 44.7,30.35 44.7,33.4 40.26,37.85 34.8,37.85 33.91,38.73 32.38,38.73 J1.21
  Bottom 0.203: R14.2 32,43.56 32.38,43.18 32.38,41.27 J1.21 | v46.35,28.32 46.1,28.57 U3.4
PI_MOSI
  Bottom 0.203: U1.11 27.94,33.02 27.43,33.53 27.43,34.54 27.81,34.92 30.1,34.92 30.86,35.69 30.86,37.21 J1.19
PI_RX
  Bottom 0.203: R4.1 46.1,43.69 46.35,43.43 J1.10 46.35,42.42 45.09,41.15 45.09,39.24 44.07,38.23 44.07,37.34 43.43,36.7 37.72,36.7 36.32,35.31 36.32,35.18 35.43,34.29 35.43,33.4 35.05,33.02 U1.4
PI_SCK
  Bottom 0.203: U1.13 29.85,35.56 30.23,35.94 30.23,37.08 29.85,37.47 29.85,38.48 28.58,39.75 J1.23
RX
  Bottom 0.203: R31.1 51.05,48.13 48.89,50.29 J3.3
RX_!RE  (via drill 0.33)
  Top 0.203: v54.61,13.72 51.69,13.72 51.31,14.1 v51.31,16.26
  Bottom 0.203: U6.2 v54.61,13.72 | U7.2 20.86,28.96 22.73,28.96 23.37,28.32 23.37,27.56 24.51,26.42 24.64,26.42 25.65,25.4 26.42,25.4 27.43,26.42 29.08,26.42 30.23,25.27 31.88,25.27 32.89,24.26 37.85,24.26 38.35,23.75 38.73,23.75 39.5,22.99 43.05,22.99 44.32,21.72 49.15,21.72 50.04,20.83 50.04,19.81 50.42,19.43 50.42,18.29 50.67,18.03 50.67,17.02 51.31,16.38 v51.31,16.26
  Bottom 0.254: R29.1 58.13,9.61 59.05,10.54 59.05,13.21 58.55,13.72 U6.2
RX_DE  (via drill 0.33)
  Top 0.203: v46.61,10.16 48.89,10.16 50.55,11.81 50.55,13.46 50.42,13.59 50.42,16.64 50.67,16.89 50.67,18.03 50.29,18.41 50.29,19.94 v47.62,22.61 | v26.67,27.94 26.67,29.34 26.92,29.59 26.92,32.64 25.02,34.54 25.02,36.7 24,37.72 18.92,37.72 v18.29,37.08
  Bottom 0.203: R32.1 45.85,9.02 46.61,9.78 v46.61,10.16 | v26.67,27.94 26.92,27.69 29.59,27.69 30.99,26.29 32.38,26.29 33.27,25.4 41.53,25.4 44.58,22.35 47.37,22.35 v47.62,22.61 | U7.26 18.29,36.36 v18.29,37.08
RX_RPU  (via drill 0.33)
  Top 0.203: v46.74,25.78 48.39,24.13 49.66,24.13 50.42,23.37 54.99,23.37 56.64,21.72 56.64,15.62 v56.01,14.99
  Bottom 0.203: v46.74,25.78 46.74,26.8 46.23,27.3 U3.5 | v56.01,14.99 U6.1
  Bottom 0.305: U6.1 57.66,15.91 R22.1
SCK  (via drill 0.33)
  Top 0.203: J8.3 49.02,29.08 49.15,29.21 50.04,29.21 50.29,29.46 50.29,31.37 v50.93,32
  Bottom 0.203: R28.1 50.16,32.77 v50.93,32
SCL
  Bottom 0.203: R35.1 7.79,48.73 7.24,49.28 6.44,49.28 R37.1 5.68,49.57 5.46,49.78 5.46,50.67 5.33,50.8 J5.1
SCL1  (via drill 0.33)
  Top 0.203: v40,45.34 40.51,45.34 40.64,45.47 42.16,45.47 42.54,45.09 44.45,45.09 45.59,43.94 47.12,43.94 47.62,43.43 47.62,42.04 48.39,41.27 49.53,41.27 50.8,40.01 J1.5 | v35.56,45.34 34.42,45.34 34.16,45.09 22.86,45.09 22.61,45.34 21.84,45.34 20.96,44.45 v19.69,44.45 | v20.83,35.81 20.83,35.56 20.32,35.05 19.18,35.05 16.26,32.13 v16.26,29.97
  Bottom 0.203: v40,45.34 39.12,45.34 38.86,45.09 36.2,45.09 35.94,45.34 v35.56,45.34 | v19.69,44.45 19.69,39.24 20.57,38.35 20.57,36.07 v20.83,35.81 | U7.6 16.51,28.78 16.51,29.34 16.26,29.59 v16.26,29.97
SDA  (via drill 0.33)
  Top 0.203: v8.51,46.61 7.87,46.61 6.73,45.47 5.84,45.47 5.33,45.97 5.33,46.74 5.84,47.24 6.22,47.24 6.73,47.75 J5.2
  Bottom 0.203: v8.51,46.61 7.79,45.89 R34.1 7.15,44.7 R36.1
SDA1  (via drill 0.33)
  Top 0.203: v40.89,44.58 42.04,44.58 42.16,44.45 44.2,44.45 45.09,43.56 45.09,42.04 45.85,41.27 47.12,41.27 47.62,40.77 47.62,39.37 48.26,38.73 52.7,38.73 J1.3 | v34.8,44.45 v22.23,44.45 | v21.46,34.8 21.08,34.42 19.69,34.42 18.42,33.15 18.42,32.51 19.3,31.62 19.3,29.59 v20.96,27.94
  Bottom 0.203: v40.89,44.58 40.77,44.58 40.64,44.45 v34.8,44.45 | v22.23,44.45 22.23,42.16 21.84,41.78 21.84,40.89 22.23,40.51 22.23,39.37 21.21,38.35 21.21,36.7 21.84,36.07 21.84,35.18 v21.46,34.8 | 20.83,27.94 v20.96,27.94 20.75,27.94 U7.3
SHUTDOWN  (via drill 0.33)
  Top 0.203: J1.31 17.78,39.37 17.02,39.37 16.38,38.73 15.24,38.73 14.61,39.37 14.61,40.51 13.84,41.27 v12.06,41.27 | v13.21,47.5 13.46,47.24 19.94,47.24 21.46,48.77 26.54,48.77 v26.8,48.51 27.05,48.77 35.81,48.77 37.46,47.12 37.46,39.24 38.23,38.48 40.51,38.48 45.34,33.66 45.34,31.88 45.72,31.5 v46.61,31.5
  Bottom 0.203: v12.06,41.27 12.06,43.05 12.95,43.94 12.95,47.24 v13.21,47.5 | 26.54,48.26 v26.8,48.51 26.12,47.84 R40.1 | U3.12 41.91,29.84 43.81,31.75 46.35,31.75 v46.61,31.5
SHUTDWN  (via drill 0.33)
  Top 0.203: v4.95,23.75 4.95,26.16 TP1.TP
  Bottom 0.203: U7.12 12.63,27.3 12.32,27.3 11.43,26.42 7.49,26.42 7.24,26.67 TP1.TP | R39.2 3.85,22.64 v4.95,23.75
SPI_IOREF  (via drill 0.33)
  Top 0.203: v38.35,45.97 38.35,44.83 40,43.18 40,41.66 40.39,41.27 41.91,41.27 42.54,40.64 42.54,39.24 43.05,38.73 43.56,38.73 44.07,38.23 44.07,36.96 46.74,34.29 52.07,34.29 52.58,34.8 52.58,35.81 53.09,36.32 53.85,36.32 54.74,35.43 v54.74,35.18 | v34.8,46.23 34.54,45.97 34.16,45.97 33.91,45.72 23.11,45.72 22.86,45.97 21.59,45.97 21.34,45.72 v20.96,45.72
  Bottom 0.203: J8.2 51.56,30.86 52.07,31.37 R27.1 53.12,32.55 53.55,32.98 R18.1 54.36,34.8 v54.74,35.18 | v34.8,46.23 35.94,46.23 36.45,45.72 38.1,45.72 v38.35,45.97 | v20.96,45.72 20.7,45.72 19.43,46.99 16.68,46.99 R16.1
TX  (via drill 0.33)
  Top 0.203: R13.2 26.42,23.62 26.92,23.11 26.92,22.23 | 26.92,22.23 26.92,21.72 26.29,21.08 26.29,19.94 25.4,19.05 25.4,9.78 v27.43,7.75 | v46.48,32.77 50.29,32.77 50.42,32.89 54.1,32.89 v55.37,34.16 | v34.16,21.59 35.05,22.48 39.75,22.48 40.51,23.24 40.51,29.08 41.15,29.72 v41.15,30.61 | v27.43,22.23 26.92,22.23
  Bottom 0.203: J3.4 47.62,49.53 48.64,49.53 51.31,46.86 56.13,46.86 58.55,44.45 58.55,37.72 58.29,37.47 57.15,37.47 55.63,35.94 55.63,34.42 v55.37,34.16 | v46.48,32.77 46.1,32.38 U3.1 43.43,32.38 41.66,30.61 v41.15,30.61 | v27.43,7.75 27.9,7.75 R12.2 | v34.16,21.59 34.16,21.84 33.53,22.48 32.38,22.48 31.88,21.97 30.86,21.97 30.23,22.61 27.81,22.61 v27.43,22.23
TX_!RE  (via drill 0.33)
  Top 0.203: v17.15,37.47 17.91,38.23 24.38,38.23 25.65,36.96 25.65,34.8 27.56,32.89 27.56,29.84 28.58,28.83 28.58,25.27 v28.19,24.89 | v24.89,22.35 24.89,20.57 24,19.68 24,12.06 23.37,11.43 22.61,11.43 21.97,12.06 v21.84,12.06
  Bottom 0.203: U7.25 17.15,36.34 v17.15,37.47 | v24.89,22.35 24.89,22.61 25.27,22.99 25.4,22.99 26.16,23.75 26.67,23.75 27.81,24.89 v28.19,24.89 | R9.2 18.29,10.79 18.92,11.43 U2.2 21.21,11.43 v21.84,12.06
TX_DE
  Bottom 0.203: U7.9 13.61,24.89 10.29,24.89 9.02,23.62 9.02,22.86 9.53,22.35 9.53,17.65 9.78,17.4 13.08,17.4 13.59,16.89 15.11,16.89 15.75,16.26 16.64,16.26 16.89,16 16.89,13.93 R10.2
TX_RPU  (via drill 0.33)
  Top 0.203: v31.37,19.43 31.62,19.68 33.15,19.68 33.4,19.94 33.4,21.08 33.27,21.21 33.27,21.97 33.78,22.48 34.16,22.48 34.8,23.11 35.69,23.11 36.96,24.38 36.96,25.4 36.07,26.29 36.07,27.05 36.45,27.43 v36.45,28.45
  Bottom 0.203: v36.45,28.45 37.21,28.45 37.46,28.7 38.1,28.7 38.61,29.21 42.8,29.21 43.05,29.46 43.05,30.23 43.94,31.11 U3.2 | U2.4 20.19,14.1 20.96,14.86 21.21,14.86 21.93,15.58 R11.2 21.97,15.91 21.97,18.67 22.61,19.3 23.5,19.3 23.62,19.18 26.29,19.18 27.05,19.94 28.96,19.94 29.72,19.18 31.12,19.18 v31.37,19.43
VIN
  Top 0.61: 55.56,4.89 55.37,4.7 51.12,4.7 50.93,4.83 | 38.73,4.83 38.54,4.7 34.54,4.7
  Top 0.813: J7.1 32.38,2.54 34.54,4.7 | 55.56,4.89 58.67,8 58.67,27.43 U5.1 | 50.93,4.83 38.73,4.83
  Bottom 0.61: C4.1 U5.1
XTAL1
  Bottom 0.203: U7.7 18,26.16 18.8,26.16 19.56,25.4 19.56,24.64 19.05,24.13 18.29,24.13 17.86,23.7 Y1.1 17.86,22.31 16,20.45 C11.1 16,19.81
XTAL2
  Bottom 0.203: C12.1 13.84,20.83 12.36,22.31 Y1.2 14.1,23.11 15.88,24.89 17.15,24.89 17.53,25.27 17.53,25.5 U7.8

### Text on the board
tPlace: 0V | 13 | 12 | 11 | 10 | 9 | 8 | 7 | 6 | 5 | 4 | 3 | 2 | TX | RX | SCL | SDA | +5V | MNG / ICSP | PI3V3 | 0V | !RST | TOOL-CHAIN AT | MOSI | HOST / !DSR | SCK | NETWORK EDGE | +5V | 3V3 | MISO | HOST / !DTR | MISO | IOREF | OC1A | ICP1 | SCK | MOSI | !RESET | 0V | VIN | RPUBUS.ORG | SHUTDOWN | RPUpi | 16197^4 | IOREF | !RESET | 3V3 | 5V | 0V | 0V | VIN | ADC2 | ADC4 | ADC6 | ADC0 | ADC1 | ADC3 | ADC5 | ADC7 | 0V
bPlace: RPUpi | RPUBUS.ORG